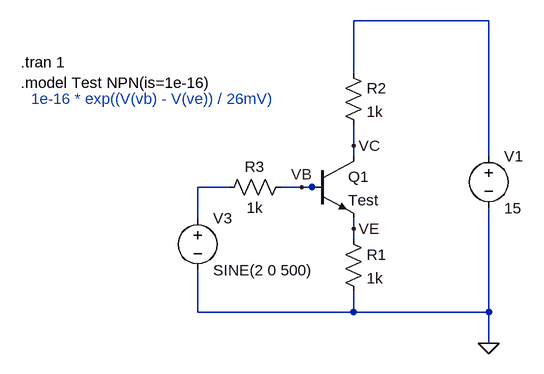
[diagram p0: schematic Draft14.asc]
Draft14.asc, the LTspice schematic file:
Version 4
SHEET 1 880 680
WIRE 704 64 496 64
WIRE 496 144 496 64
WIRE 496 256 496 224
WIRE 496 272 496 256
WIRE 704 272 704 64
WIRE 304 320 256 320
WIRE 416 320 384 320
WIRE 432 320 416 320
WIRE 448 320 432 320
WIRE 256 368 256 320
WIRE 496 384 496 368
WIRE 496 400 496 384
WIRE 256 512 256 448
WIRE 496 512 496 480
WIRE 496 512 256 512
WIRE 704 512 704 352
WIRE 704 512 496 512
WIRE 704 560 704 512
FLAG 704 560 0
FLAG 416 320 VB
FLAG 496 384 VE
FLAG 496 256 VC
SYMBOL npn 432 272 R0
SYMATTR InstName Q1
SYMATTR Value Test
SYMBOL res 480 384 R0
SYMATTR InstName R1
SYMATTR Value 1k
SYMBOL res 480 128 R0
SYMATTR InstName R2
SYMATTR Value 1k
SYMBOL res 400 304 R90
WINDOW 0 0 56 VBottom 2
WINDOW 3 32 56 VTop 2
SYMATTR InstName R3
SYMATTR Value 1k
SYMBOL voltage 704 256 R0
SYMATTR InstName V1
SYMATTR Value 15
SYMBOL voltage 256 352 R0
SYMATTR InstName V3
SYMATTR Value SINE(2 0 500)
TEXT -16 128 Left 2 !.tran 1\n.model Test NPN(is=1e-16)
TEXT 0 184 Left 2 ;1e-16 * exp((V(vb) - V(ve)) / 26mV)

The netlist it stands for:
* Draft14.asc
Q1 VC VB VE 0 Test
R1 VE 0 1k
R2 N001 VC 1k
R3 VB N002 1k
V1 N001 0 15
V3 N002 0 SINE(2 0 500)
.model NPN NPN
.model PNP PNP
.lib standard.bjt
.tran 1
.model Test NPN(is=1e-16)
* 1e-16 * exp((V(vb) - V(ve)) / 26mV)
.backanno
.end